# Altium schematic sheet Sensors.SchDoc
size A4
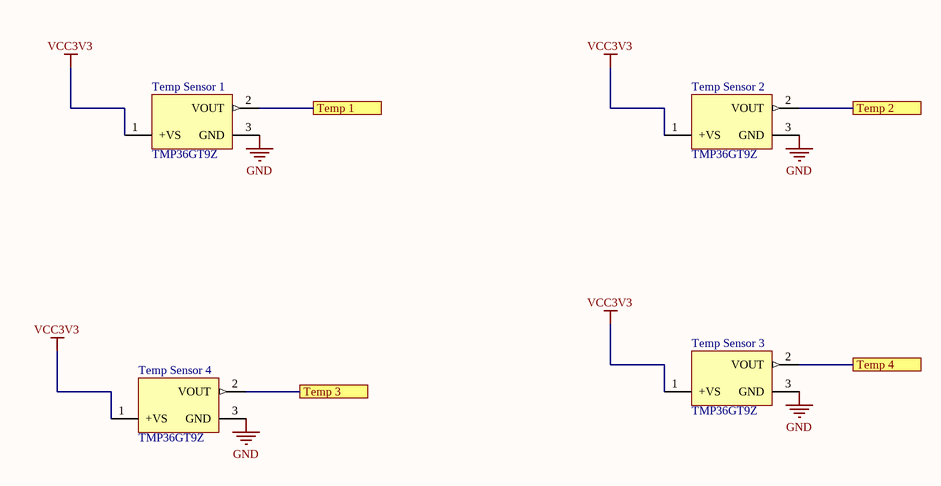
[diagram p0: Sensors.SchDoc]

## Parts
Temp_Sensor_1  TMP36GT9Z  [ADI-T-3]
Temp_Sensor_2  TMP36GT9Z  [ADI-T-3]
Temp_Sensor_3  TMP36GT9Z  [ADI-T-3]
Temp_Sensor_4  TMP36GT9Z  [ADI-T-3]

## Ports
Temp 1, Temp 2, Temp 3, Temp 4

## Nets
GND: Temp_Sensor_1.3(GND) Temp_Sensor_2.3(GND) Temp_Sensor_3.3(GND) Temp_Sensor_4.3(GND)
VCC3V3: Temp_Sensor_1.1(+VS) Temp_Sensor_2.1(+VS) Temp_Sensor_3.1(+VS) Temp_Sensor_4.1(+VS)
Temp 1: Temp_Sensor_1.2(VOUT) ; port Temp 1
Temp 2: Temp_Sensor_2.2(VOUT) ; port Temp 2
Temp 3: Temp_Sensor_4.2(VOUT) ; port Temp 3
Temp 4: Temp_Sensor_3.2(VOUT) ; port Temp 4

## Library data of the parts
Temp_Sensor_1-Temp_Sensor_4 = CMP-0887-00067-1: Low Voltage Temperature Sensor, 2.7 to 5.5 V Supply, Industrial, 3-pin TO92 (T-3), Tray; Manufacturer: Analog Devices; ComponentLink2Description: Datasheet; PackageReference: T-3; Packing: Tray; ComponentLink2URL: http://www.analog.com/static/imported-files/data_sheets/TMP35_36_37.pdf; ComponentLink4Description: Product URL; ComponentLink3Description: Package Specification; Code_JEDEC: TO-226-AA; PartNumber: TMP36GT9Z; PackageDescription: 3-Pin Plastic Header-Style Package, 1.27 mm Pitch; PackageVersion: 042208-A, 04/2008; ComponentLink3URL: http://www.analog.com/static/imported-files/packages/PKG_PDF/TO-92(T)/T_3.pdf; ComponentLink1Description: Manufacturer URL; Supply Voltage Range: 2.7 to 5.5 V; Mounting Technology: Through Hole; DatasheetVersion: Rev. F; ComponentLink4URL: http://www.analog.com/en/mems-sensors/digital-temperature-sensors/tmp36/products/product.html; ComponentLink1URL: http://www.analog.com/en/index.html